# EAGLE design RPICON (EAGLE 9.1.0)
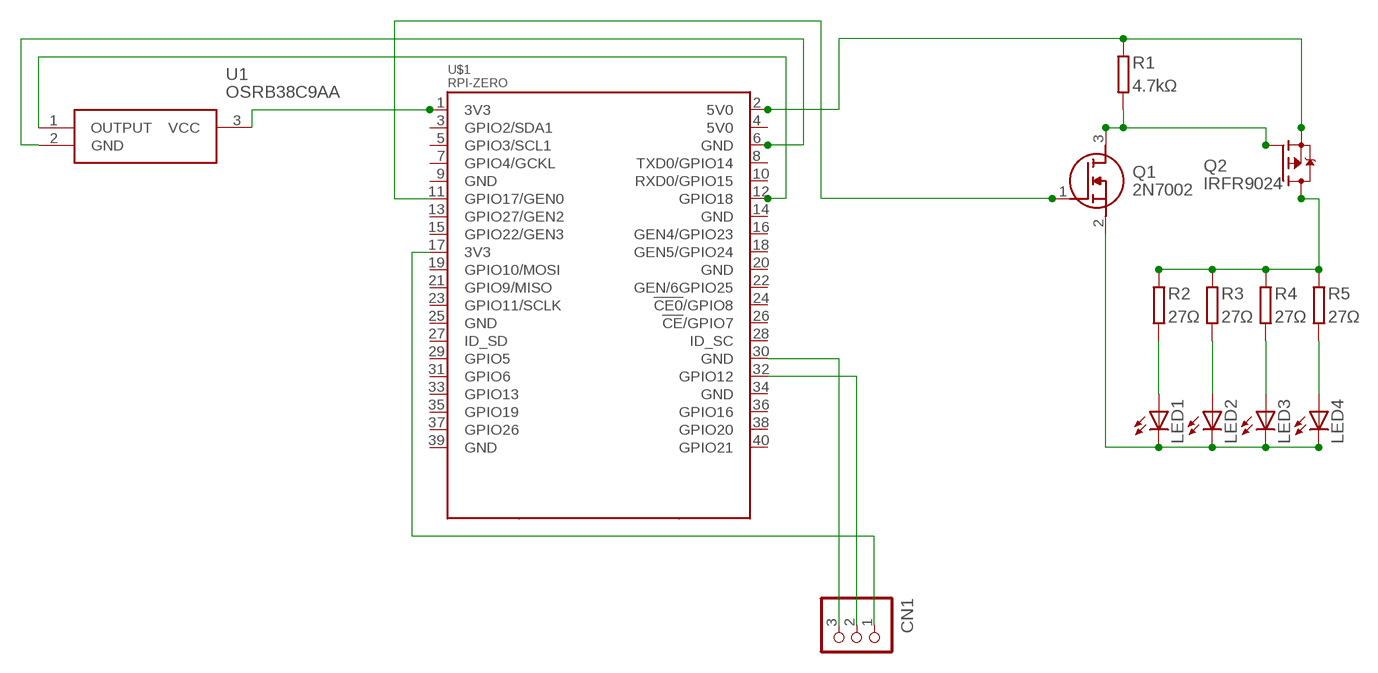
[diagram p0: schematic, sheet 1]

## Parts
CN1  S3B-XH-A  [S3B-XH-A]
LED1  LED5MM  [LED5MM]
LED2  LED5MM  [LED5MM]
LED3  LED5MM  [LED5MM]
LED4  LED5MM  [LED5MM]
Q1  2N7002  [SOT95P240X120-3N]
Q2  IRFR9024  FDD4141TO252  [TO252]
R1  4.7kΩ  RESISTOR1608  [SMD1608]
R2  27Ω  RESISTOR1608  [SMD1608]
R3  27Ω  RESISTOR1608  [SMD1608]
R4  27Ω  RESISTOR1608  [SMD1608]
R5  27Ω  RESISTOR1608  [SMD1608]
U1  OSRB38C9AA  [OSRB38C9AA]
U$1  RPI-ZERO  [RASPBERRYPI_BASTELSTUBE_V13_RASPI_BOARD_B+_FULL]

## Nets
3V3: U1.3(VCC) U$1.1(3V3)
3V3@1: CN1.1 U$1.17(3V3)
5V: Q2.2(S) R1.1 U$1.2(5V0)
BGND: LED1.K(C) LED2.K(C) LED3.K(C) LED4.K(C) Q1.2(S)
GND: U1.2(GND) U$1.6(GND)
GND@1: CN1.3 U$1.30(GND)
N$1: U1.1(OUTPUT) U$1.12(GPIO18)
N$2: Q1.1(G) U$1.11(GPIO17/GEN0)
N$3: Q1.3(D) Q2.1(G) R1.2
N$4: CN1.2 U$1.32(GPIO12)
N$5: Q2.3(D) R2.1 R3.1 R4.1 R5.1
N$6: LED1.A R2.2
N$7: LED2.A R3.2
N$8: LED3.A R4.2
N$9: LED4.A R5.2
Unconnected: U$1.3(GPIO2/SDA1) U$1.4(5V0) U$1.5(GPIO3/SCL1) U$1.7(GPIO4/GCKL) U$1.8(TXD0/GPIO14) U$1.9(GND) U$1.10(RXD0/GPIO15) U$1.13(GPIO27/GEN2) U$1.14(GND) U$1.15(GPIO22/GEN3) U$1.16(GEN4/GPIO23) U$1.18(GEN5/GPIO24) U$1.19(GPIO10/MOSI) U$1.20(GND) U$1.21(GPIO9/MISO) U$1.22(GEN/6GPIO25) U$1.23(GPIO11/SCLK) U$1.24(!CE0!/GPIO8) U$1.25(GND) U$1.26(!CE!/GPIO7) U$1.27(ID_SD) U$1.28(ID_SC) U$1.29(GPIO5) U$1.31(GPIO6) U$1.33(GPIO13) U$1.34(GND) U$1.35(GPIO19) U$1.36(GPIO16) U$1.37(GPIO26) U$1.38(GPIO20) U$1.39(GND) U$1.40(GPIO21)

## Library data of the parts
CN1 = jst-xh:S3B-XH-A: Wire-to-Board 2.5mm pitch side mount connector Source: http://www.jst-mfg.com/product/pdf/jpn/XH.pdf http://www.jst-mfg.com/product/detail.php?series=277
LED1-LED4 = led:LED: LED OSRAM: - CHIPLED LG R971, LG N971, LY N971, LG Q971, LY Q971, LO R971, LY R971 LH N974, LH R974 LS Q976, LO Q976, LY Q976 LO Q996 - Hyper CHIPLED LW Q18S LB Q993, LB Q99A, LB R99A - SideLED LS A670, LO A670, LY A670, LG A670, LP A670 LB A673, LV A673, LT A673, LW A673 LH A674 LY A675 LS A676, LA A676, LO A676, LY A676, LW A676 LS A679, LY A679, LG A679 - Hyper Micro SIDELED® LS Y876, LA Y876, LO Y876, LY Y876 LT Y87S - SmartLED LW L88C, LW L88S LB L89C, LB L89S, LG L890 LS L89K, LO L89K, LY L89K LS L896, LA L896, LO L896, LY L896 - TOPLED LS T670, LO T670, LY T670, LG T670, LP T670 LSG T670, LSP T670, LSY T670, LOP T670, LYG T670 LG T671, LOG T671, LSG T671 LB T673, LV T673, LT T673, LW T673 LH T674 LS T676, LA T676, LO T676, LY T676, LB T676, LH T676, LSB T676, LW T676 LB T67C, LV T67C, LT T67C, LS T67K, LO T67K, LY T67K, LW E67C LS E67B, LA E67B, LO E67B, LY E67B, LB E67C, LV E67C, LT E67C LW T67C LS T679, LY T679, LG T679 LS T770, LO T770, LY T770, LG T770, LP T770 LB T773, LV T773, LT T773, LW T773 LH T774 LS E675, LA E675, LY E675, LS T675 LS T776, LA T776, LO T776, LY T776, LB T776 LHGB T686 LT T68C, LB T68C - Hyper Mini TOPLED® LB M676 - Mini TOPLED Santana® LG M470 LS M47K, LO M47K, LY M47K Source: http://www.osram.convergy.de LUXEON: - LUMILED® LXK2-PW12-R00, LXK2-PW12-S00, LXK2-PW14-U00, LXK2-PW14-V00 LXK2-PM12-R00, LXK2-PM12-S00, LXK2-PM14-U00 LXK2-PE12-Q00, LXK2-PE12-R00, LXK2-PE12-S00, LXK2-PE14-T00, LXK2-PE14-U00 LXK2-PB12-K00, LXK2-PB12-L00, LXK2-PB12-M00, LXK2-PB14-N00, LXK2-PB14-P00, LXK2-PB14-Q00 LXK2-PR12-L00, LXK2-PR12-M00, LXK2-PR14-Q00, LXK2-PR14-R00 LXK2-PD12-Q00, LXK2-PD12-R00, LXK2-PD12-S00 LXK2-PH12-R00, LXK2-PH12-S00 LXK2-PL12-P00, LXK2-PL12-Q00, LXK2-PL12-R00 Source: www.luxeon.com KINGBRIGHT: KA-3528ASYC Source: www.kingbright.com
Q1 = 2N7002:2N7002: MOSFET N-Channel 60V 0.115A SOT23 Fairchild 2N7002 N-channel MOSFET Transistor, 0.115 A, 60 V, 3-Pin SOT-23 Source: Datasheet <http://www.onsemi.com/pub/Collateral/NDS7002A-D.PDF>; DESCRIPTION: MOSFET N-Channel 60V 0.115A SOT23 Fairchild 2N7002 N-channel MOSFET Transistor, 0.115 A, 60 V, 3-Pin SOT-23; HEIGHT: 1.2mm; MANUFACTURER_NAME: Fairchild Semiconductor; MANUFACTURER_PART_NUMBER: 2N7002; MOUSER_PART_NUMBER: 512-2N7002; MOUSER_PRICE-STOCK: https://www.mouser.com/Search/Refine.aspx?Keyword=512-2N7002
Q2 = transistor-fet:FDD4141: P-Channel PowerTrench® MOSFET Source: FDD4141.pdf
R1-R5 = generic:RESISTOR: Generic Registor
U1 = OSRB38C9AA:OSRB38C9AA: 7.4*6.2*5.25mm Infrared Receiver Module Source: Datasheet <http://akizukidenshi.com/download/OSRB38C9AA.pdf>; DESCRIPTION: 7.4*6.2*5.25mm Infrared Receiver Module; HEIGHT: mm; MANUFACTURER_NAME: OptoSupply; MANUFACTURER_PART_NUMBER: OSRB38C9AA
U$1 = RPI-Zero:RPI-ZERO

## Board
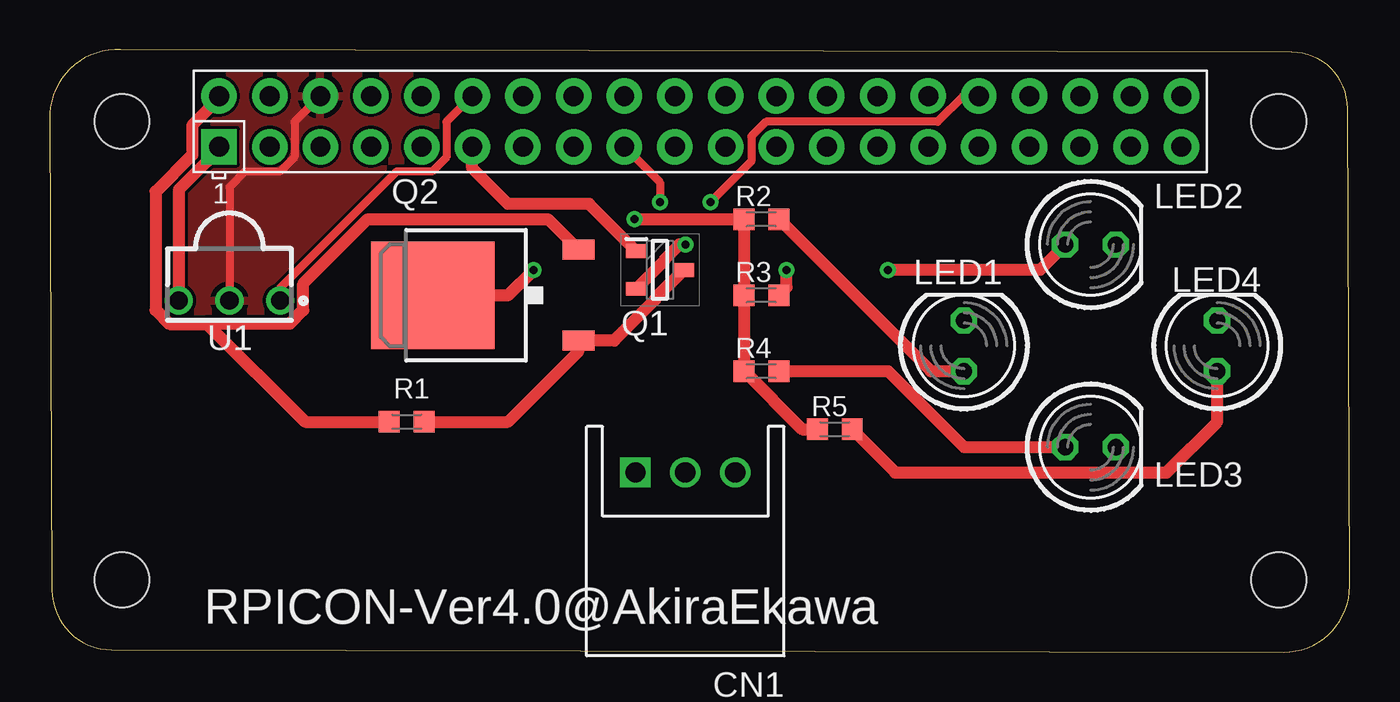
[diagram p1: board, top side]
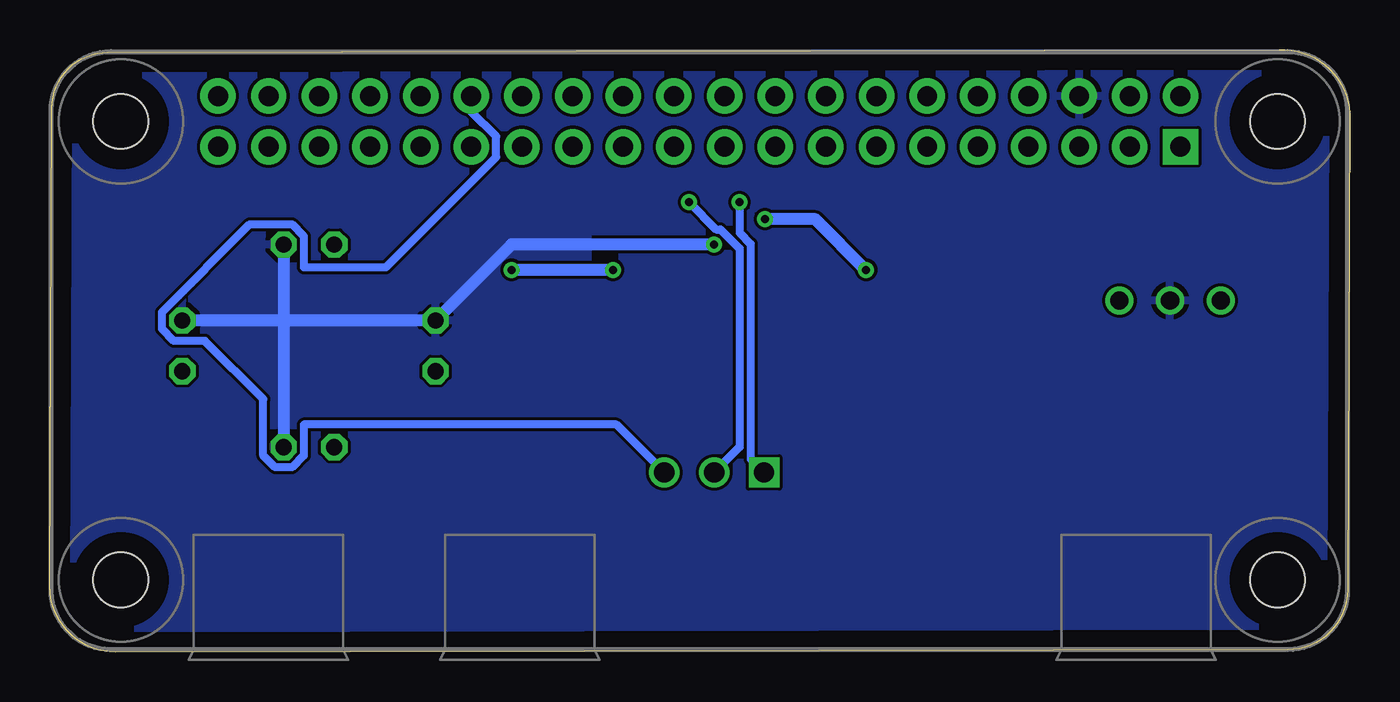
[diagram p2: board, bottom side, seen from below]

Size 65.17 x 30.21 mm. Coordinates in mm from the lower left corner, seen from the top.
Outline: 0,27.02 0.1,3.12 arc90 3.11,0.11 61.87,0 arc90 65.18,3.31 65.07,27.29 arc90 62.27,30.09 3.56,30.2 arc90 0,27.02
Copper layers (1*16): Top 0.035mm / dielectric 1.5mm / Bottom 0.035mm
Design rules "default": minimum track width 6mil, minimum drill 0.35mm, track to track 6mil, track to pad 6mil, pad to pad 6mil, via to via 6mil, smd to smd 6mil, copper to edge 40mil, drill to drill 6mil, minimum pad ring 10mil, minimum via ring 8mil, stop-mask expansion 4mil, vias tented up to drill 0mil, thermal gap 10mil

### Footprints (pad centres in the part's own frame; a part is rotated, then mirrored left to right if it is on the bottom)
S3B-XH-A = drill 1.016 square: 1 2.5,0 | drill 1.016: 2 0,0; 3 -2.5,0
LED5MM = drill 0.813 octagon: A -1.27,0; K 1.27,0
SOT95P240X120-3N = smd 1 x 0.7: 1 -1.2,0.95; 2 -1.2,-0.95; 3 1.2,0
TO252 = smd 1 x 1.6: 1 -2.28,-4.8; 2 2.28,-4.8 | smd 5.4 x 6.2: 3 0,2.5
SMD1608 = smd 1.05 x 1.08: 1 -0.875,0; 2 0.875,0
OSRB38C9AA = drill 0.91 pad 1.41: 1 -2.54,-1; 2 0,-1; 3 2.54,-1
RASPBERRYPI_BASTELSTUBE_V13_RASPI_BOARD_B+_FULL = drill 1 pad 1.778 square: 1 8.37,25.23 | drill 1 pad 1.778: 2 8.37,27.77; 3 10.91,25.23; 4 10.91,27.77; 5 13.45,25.23; 6 13.45,27.77; 7 15.99,25.23; 8 15.99,27.77; 9 18.53,25.23; 10 18.53,27.77; 11 21.07,25.23; 12 21.07,27.77; 13 23.61,25.23; 14 23.61,27.77; 15 26.15,25.23; 16 26.15,27.77; 17 28.69,25.23; 18 28.69,27.77; 19 31.23,25.23; 20 31.23,27.77; 21 33.77,25.23; 22 33.77,27.77; 23 36.31,25.23; 24 36.31,27.77; 25 38.85,25.23; 26 38.85,27.77; 27 41.39,25.23; 28 41.39,27.77; 29 43.93,25.23; 30 43.93,27.77; 31 46.47,25.23; 32 46.47,27.77; 33 49.01,25.23; 34 49.01,27.77; 35 51.55,25.23; 36 51.55,27.77; 37 54.09,25.23; 38 54.09,27.77; 39 56.63,25.23; 40 56.63,27.77 | hole 2.75: 3.5,3.5; 3.5,26.5; 61.5,3.5; 61.5,26.5

### Placement (x,y rotation side)
CN1  31.86,9.01 180 top
LED1  45.83,15.36 90 top
LED2  52.18,20.44 0 top
LED3  52.18,10.28 0 top
LED4  58.53,15.36 90 top
Q1  30.59,19.17 0 top
Q2  21.7,17.9 90 top
R1  17.89,11.55 0 top
R2  35.67,21.71 0 top
R3  35.67,17.9 0 top
R4  35.67,14.09 0 top
R5  39.36,11.17 0 top
U1  9,16.63 180 top
U$1  0.11,0.12 0 top

### Tracks (layer width: path | path; a pad name or v marks a point on that pad's centre or on a via)
3V3
  Top 0.61: U$1.1 7.9,24.77 7.9,24.62 6.46,23.19 U1.3
3V3@1  (via drill 0.4)
  Top 0.406: U$1.17 30.59,23.56 v30.59,22.57
  Bottom 0.406: v30.59,22.57 30.59,21.03 30.04,20.48 30.04,9.68 CN1.1
5V
  Top 0.61: U$1.2 8.48,27.78 7.14,26.43 7.14,24.94 5.3,23.1 5.3,17.15 5.98,16.46 7.9,16.46 | 7.9,16.46 12.81,11.55 R1.1 | 7.9,16.46 12.03,16.46 12.71,17.15 12.71,18.48 15.94,21.71 24.97,21.71 Q2.2
BGND  (via drill 0.4)
  Top 0.61: Q1.2 30.84,19.66 30.84,19.71 31.57,20.44 v31.86,20.44
  Bottom 0.61: v31.86,20.44 42.02,20.44 LED1.K 53.45,16.63 | 53.45,16.63 LED4.K | LED2.K 53.45,16.63 | 53.45,16.63 LED3.K
  pour Bottom: 38.21,29.33 38.21,0.12 64.88,0.12 64.88,29.33
GND
  Top 0.406: U1.2 9,23.33 9.78,24.11 11.54,24.11 12.27,24.83 12.27,26.6 U$1.6
  pour Bottom: 0.11,30.6 0.11,0.12 66.15,0.12 66.15,30.6
  pour Top: 0.11,30.6 0.11,0.12 64.88,0.12 64.88,30.6
GND@1
  Bottom 0.406: U$1.30 44.04,27.11 42.8,25.87 42.8,24.83 48.33,19.31 52.44,19.31 52.44,20.86 53.03,21.46 55.15,21.46 59.55,17.05 59.55,16.21 58.96,15.61 57.4,15.61 54.47,12.68 54.47,9.86 53.88,9.26 53.03,9.26 52.44,9.86 52.44,11.41 36.77,11.41 CN1.3
N$1
  Top 0.406: U1.1 11.54,18.25 17.4,24.11 19.16,24.11 19.89,24.83 19.89,26.6 U$1.12
N$2
  Top 0.61: Q1.1 27.04,22.47 22.97,22.47 21.18,24.26 U$1.11
N$3
  Top 0.61: R1.2 22.97,11.55 26.5,15.08 Q2.1 28.29,15.62 30.35,17.68 30.35,17.73 Q1.3
N$4  (via drill 0.4)
  Top 0.406: U$1.32 45.8,27.89 44.51,26.6 35.91,26.6 35.18,25.87 35.18,24.62 v33.13,22.57
  Bottom 0.406: v33.13,22.57 31.76,21.2 31.55,21.2 30.59,20.24 30.59,10.28 CN1.2
N$5  (via drill 0.4)
  Top 0.61: Q2.3 22.97,17.9 v24.24,19.17 | v29.32,21.71 R2.1 R3.1 R4.1 37.72,11.17 R5.1
  Bottom 0.61: v24.24,19.17 26.78,21.71 v29.32,21.71
N$6
  Top 0.61: R2.2 44.17,14.09 LED1.A
N$7  (via drill 0.4)
  Top 0.61: R3.2 36.94,18.3 v36.94,19.17 | LED2.A 49.64,19.17 v42.02,19.17
  Bottom 0.61: v36.94,19.17 v42.02,19.17
N$8
  Top 0.61: R4.2 42.02,14.09 45.83,10.28 LED3.A
N$9
  Top 0.61: R5.2 42.39,9.01 55.99,9.01 58.53,11.55 LED4.A

### Text on the board
tPlace: RPICON-Ver4.0@AkiraEkawa